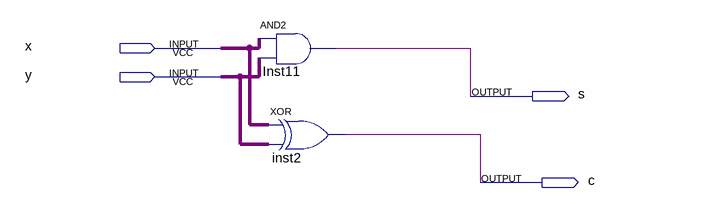
[diagram p0: schematic sheet]
// Quartus schematic Meio_Somador.bdf as structural Verilog: 2 symbols, 4 pins
module Meio_Somador (
  input  x,
  input  y,
  output s,
  output c
);

  and Inst11 (s, x, y);
  xor inst2 (c, x, y);
endmodule
